# EasyEDA schematic SCH_Fulcrum-Analog-FCU_2024-12-11.json
TITLE: Sheet_1; REV: 1.0; Date: 2024-12-10; Sheet: 1/1; Drawn By: George Stevens; Company: Your Company
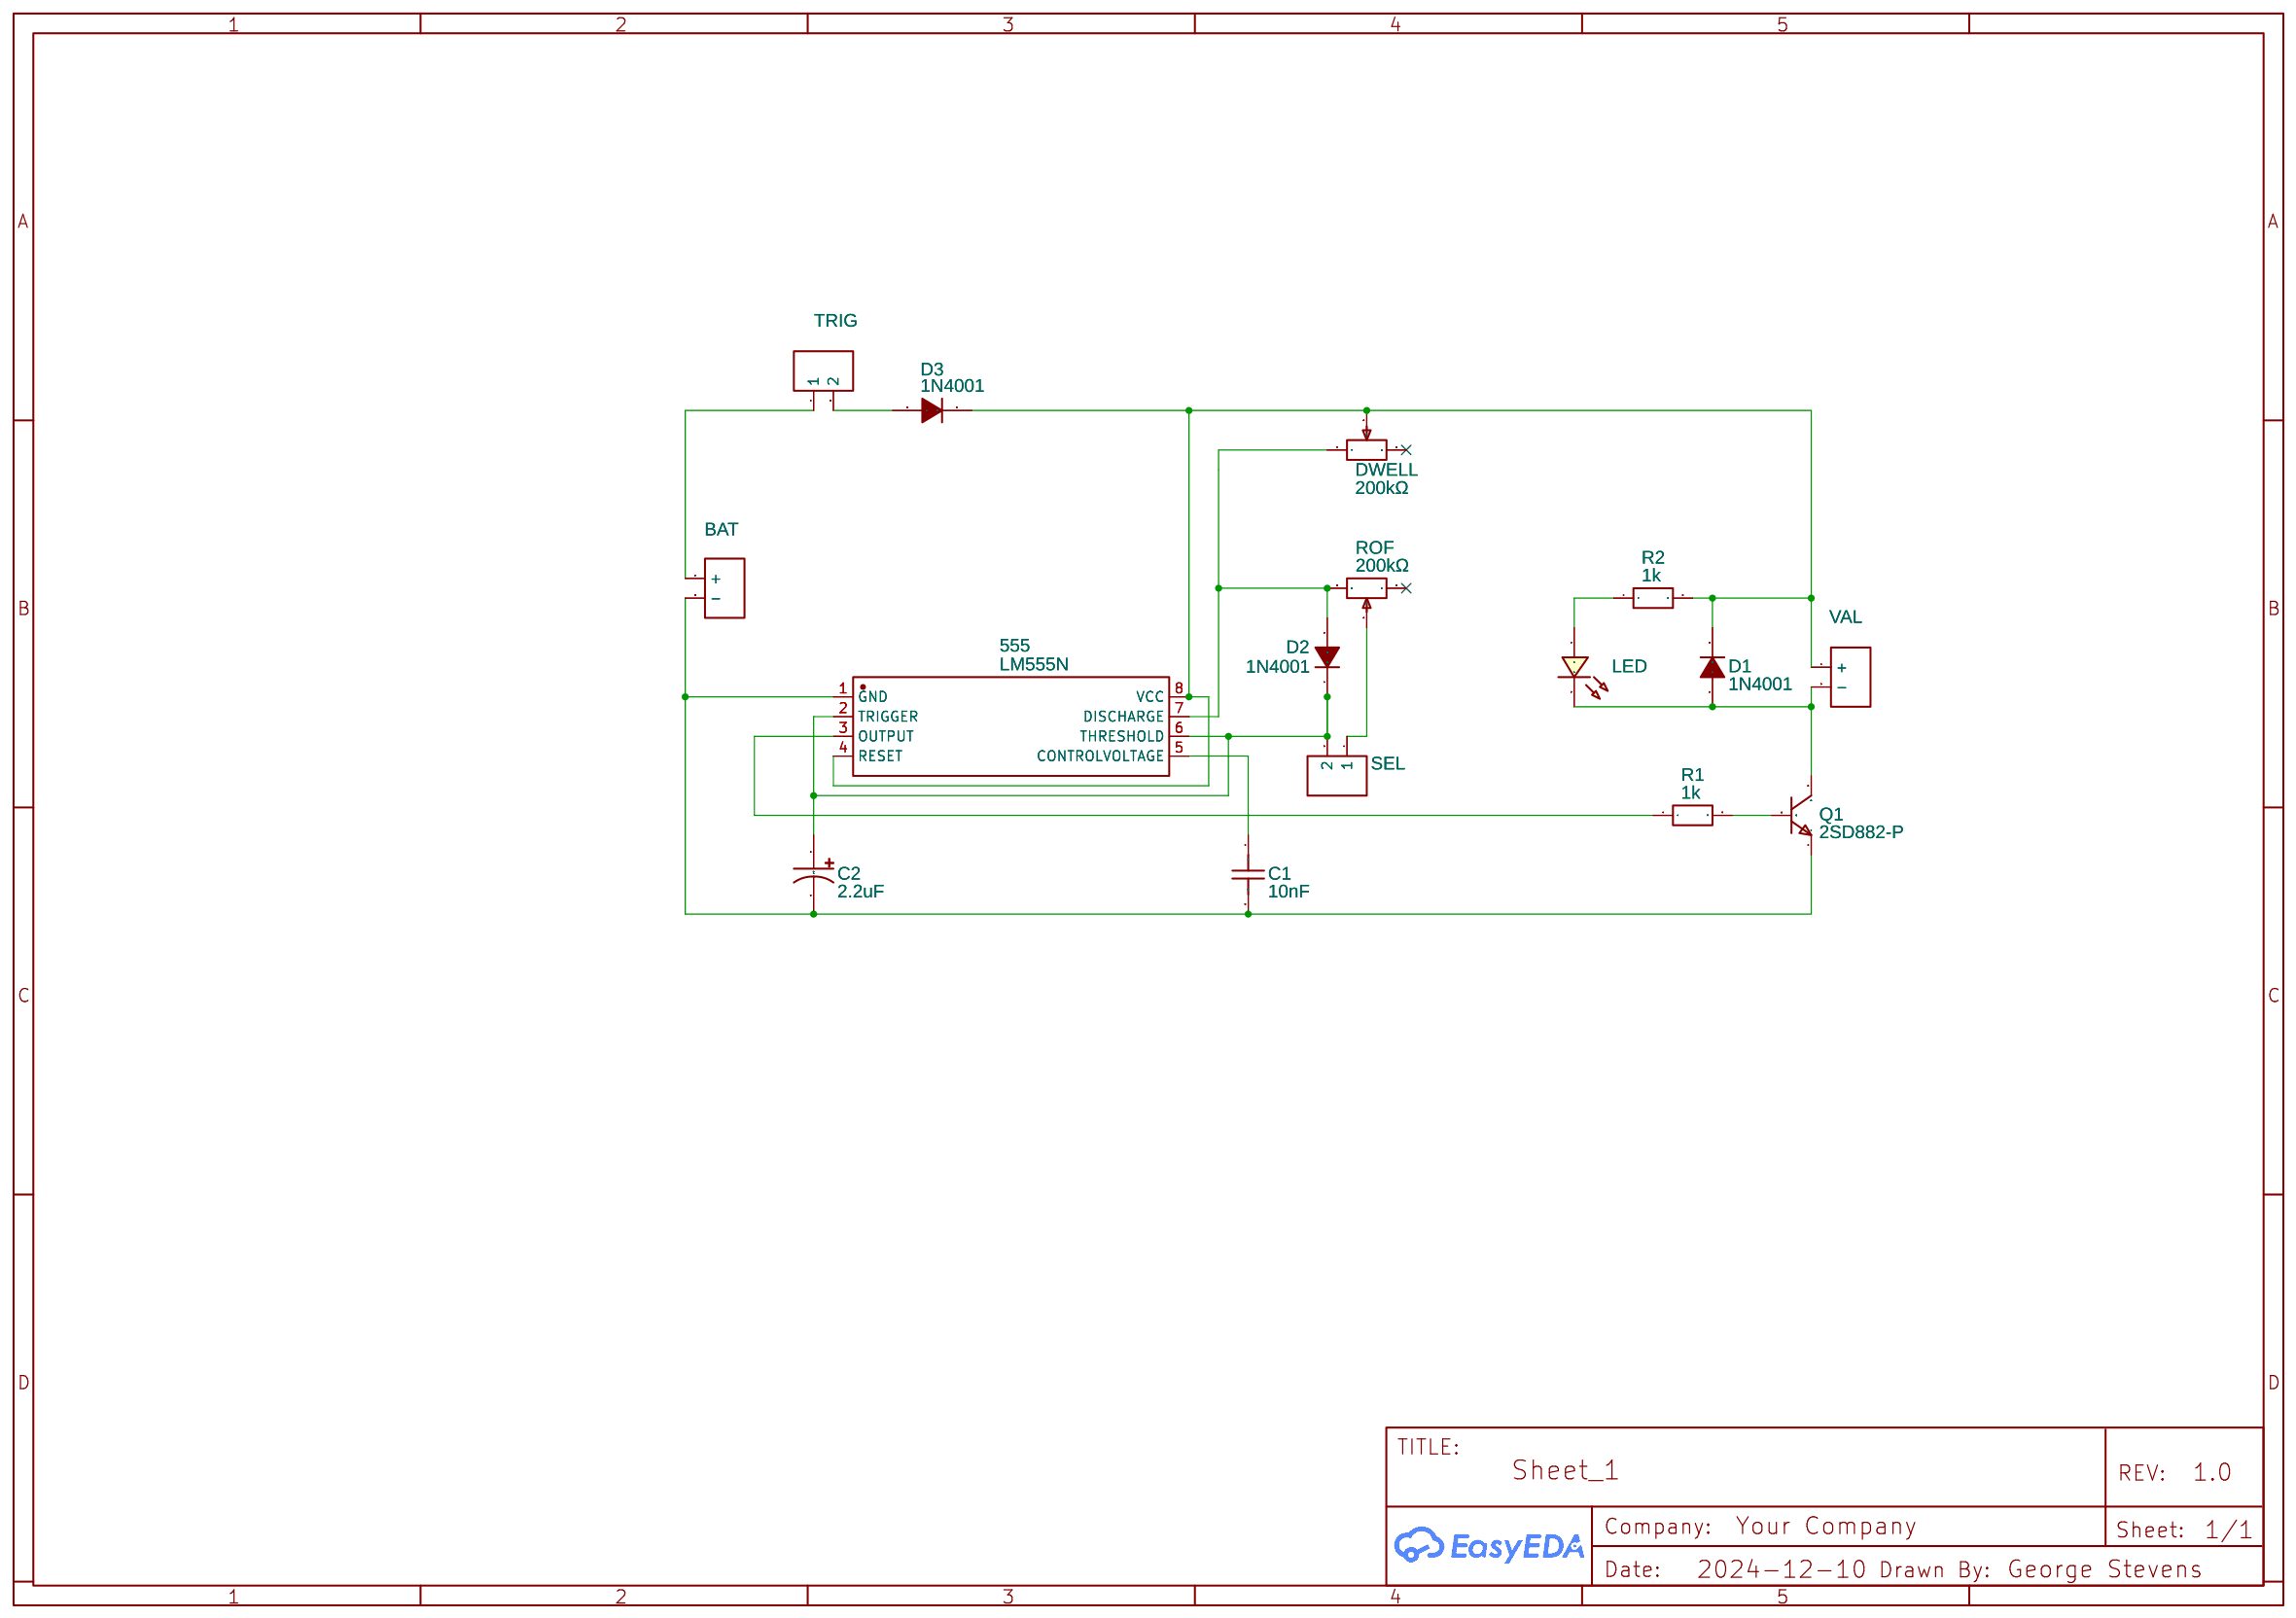
[diagram p0: schematic sheet]

## Parts
555  LM555N  [DIP-8_L9.7-W6.4-P2.54-LS7.6-BL]
BAT  HDR-M-2.54_1x2  [HDR-M-2.54_1X2]
C1  10nF  [CAP-TH_L6.5-W4.0-P5.00-D1.0]
C2  2.2uF  [CAP-TH_BD5.0-P2.00-D0.5-FD]
D1  1N4001  [DO-41_BD2.4-L4.7-P8.70-D0.9-RD]
D2  1N4001  [DO-41_BD2.4-L4.7-P8.70-D0.9-RD]
D3  1N4001  [DO-41_BD2.4-L4.7-P8.70-D0.9-RD]
DWELL  200kΩ  [RES-ADJ-TH_RM063-103]
LED  LED-TH-3mm_R  [LED-TH_BD3.0_RED]
Q1  2SD882-P  [TO-126F-3L_L8.0-W3.2-P2.30-L]
R1  1k  [R_AXIAL-0.4]
R2  1k  [R_AXIAL-0.4]
ROF  200kΩ  [RES-ADJ-TH_RM063-103]
SEL  HDR-M-2.54_1x2  [HDR-M-2.54_1X2]
TRIG  HDR-M-2.54_1x2  [HDR-M-2.54_1X2]
VAL  HDR-M-2.54_1x2  [HDR-M-2.54_1X2]

## Library data of the parts
555 = LM555N: Contributor: LCSC; Supplier: LCSC; Supplier Part: C725327; Manufacturer: HGSEMI(华冠); JLCPCB Part Class: Extended Part
BAT SEL TRIG = HDR-M-2.54_1x2: Supplier Part: C124375; Supplier: LCSC; Contributor: LCEDA_Lib
C1 = CL112J103J0501: Contributor: LCSC; Supplier: LCSC; Supplier Part: C424418; Manufacturer: KYET(科雅); JLCPCB Part Class: Extended Part
C2 = ECG1HM2R2D11OTBO: Supplier: LCSC; Supplier Part: C783465; Manufacturer: Yunxing(云星); JLCPCB Part Class: Extended Part; Contributor: lcsc
D1-D3 = 1N4001_C2456: Supplier: LCSC; Manufacturer: MDD(辰达半导体); Supplier Part: C2456; JLCPCB Part Class: Extended Part
DWELL ROF = RM063-204(200K): Contributor: lcsc; Supplier: LCSC; Supplier Part: C5205036; Manufacturer: BOCHEN(博晨); JLCPCB Part Class: Extended Part
LED = LED-TH-3mm_R: Manufacturer: EVERLIGHT(台湾亿光); Manufacturer Part: 204-10SDRD/S530-A3-L; Supplier Part: C84774; Supplier: LCSC; Contributor: LCEDA_Lib
Q1 = 2SD882-P: Contributor: LCSC; Supplier: LCSC; Supplier Part: C358522; Manufacturer: BLUE ROCKET(蓝箭); JLCPCB Part Class: Extended Part
R1 R2 = R_AXIAL-0.4_EU: Contributor: LCEDA_Lib
VAL = HDR-M-2.54_1x2: Supplier Part: C124375; Supplier: LCSC; Contributor: LCEDA_Lib; Package Display: No

## Nets
Net-(555-1): 555.1(GND) BAT.2(-) C1.2 C2.2 Q1.1(E)
Net-(555-2): 555.2(TRIGGER) 555.6(THRESHOLD) C2.1 D2.1(C) SEL.2
Net-(555-3): 555.3(OUTPUT) R1.1
Net-(555-4): 555.4(RESET) 555.8(VCC) D1.1(C) D3.1(C) DWELL.2 R2.2 VAL.1(+)
Net-(555-5): 555.5(CONTROLVOLTAGE) C1.1
Net-(555-7): 555.7(DISCHARGE) D2.2(A) DWELL.1 ROF.3
Net-(BAT-1): BAT.1(+) TRIG.1
Net-(D1-2): D1.2(A) LED.2 Q1.2(C) VAL.2(-)
Net-(D3-2): D3.2(A) TRIG.2
Net-(LED-1): LED.1 R2.1
Net-(Q1-3): Q1.3(B) R1.2
Net-(ROF-2): ROF.2 SEL.1

Not connected (* = marked no-connect by the designer): DWELL 3*; ROF 1*
